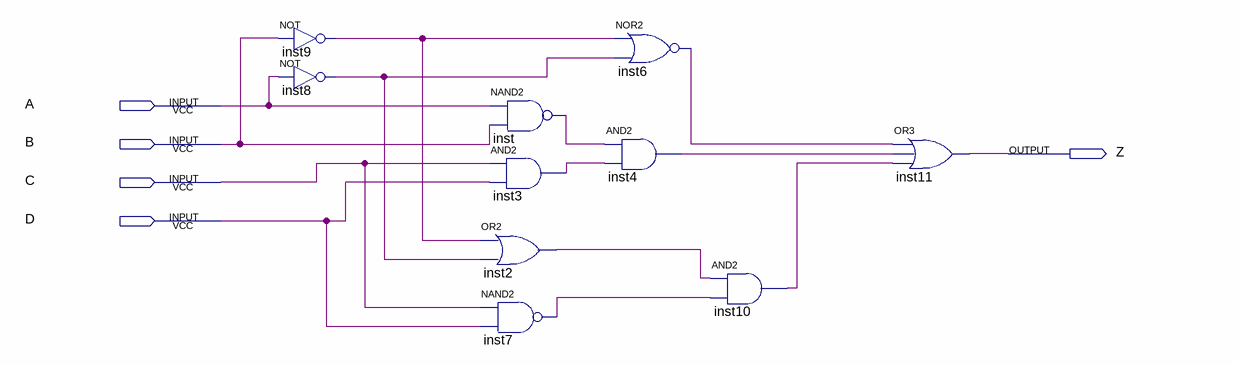
[diagram p0: schematic sheet]
// Quartus schematic Boolean_Logic.bdf as structural Verilog: 10 symbols, 5 pins
module Boolean_Logic (
  input  A,
  input  B,
  input  C,
  input  D,
  output Z
);

  wire inst2_out, inst3_out, inst4_out, inst6_out, inst7_out, inst8_out, inst9_out, inst10_out, inst_out;

  not inst9 (inst9_out, B);
  not inst8 (inst8_out, A);
  nand inst (inst_out, A, B);
  and inst3 (inst3_out, C, D);
  or inst2 (inst2_out, inst9_out, inst8_out);
  nand inst7 (inst7_out, C, D);
  nor inst6 (inst6_out, inst9_out, inst8_out);
  and inst4 (inst4_out, inst_out, inst3_out);
  and inst10 (inst10_out, inst2_out, inst7_out);
  or inst11 (Z, inst6_out, inst4_out, inst10_out);
endmodule
